# Altium schematic sheet PSU.SchDoc
size A4
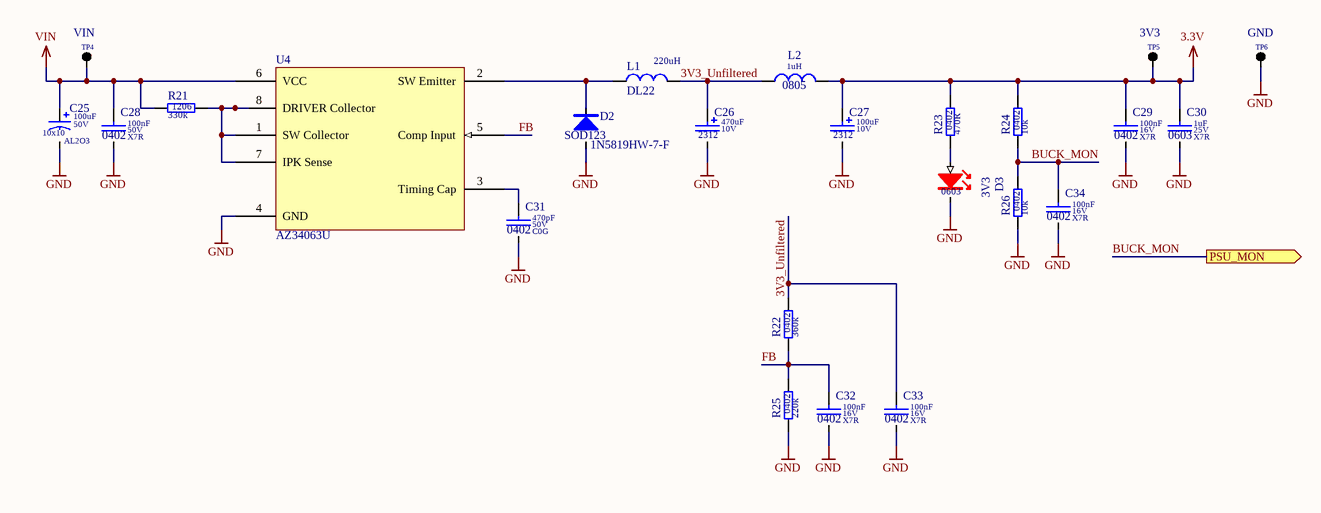
[diagram p0: PSU.SchDoc]

## Parts
C25  value 100uF  Dielectric: AL2O3  SCH_Footprint: 10x10  Voltage: 50V  [CE_D_10x10MM]  (hidden comment: Electrolytic Capacitor)
C26  value 470uF  SCH_Footprint: 2312  Voltage: 10V  [CT_2312_6032]  (hidden comment: Tantalum Capacitor)
C27  value 100uF  SCH_Footprint: 2312  Voltage: 10V  [CT_2312_6032]  (hidden comment: Tantalum Capacitor)
C28  value 100nF  Dielectric: X7R  Voltage: 50V  SCH_Footprint: 0402  [C_0402_1005]  (hidden comment: Ceramic X7R)
C29  value 100nF  Dielectric: X7R  Voltage: 16V  SCH_Footprint: 0402  [C_0402_1005]  (hidden comment: Ceramic X7R)
C30  value 1uF  Dielectric: X7R  Voltage: 25V  SCH_Footprint: 0603  [C_0603_1608]  (hidden comment: Ceramic X7R)
C31  value 470pF  Dielectric: C0G  Voltage: 50V  SCH_Footprint: 0402  [C_0402_1005]  (hidden comment: Ceramic C0G)
C32  value 100nF  Dielectric: X7R  Voltage: 16V  SCH_Footprint: 0402  [C_0402_1005]  (hidden comment: Ceramic X7R)
C33  value 100nF  Dielectric: X7R  Voltage: 16V  SCH_Footprint: 0402  [C_0402_1005]  (hidden comment: Ceramic X7R)
C34  value 100nF  Dielectric: X7R  Voltage: 16V  SCH_Footprint: 0402  [C_0402_1005]  (hidden comment: Ceramic X7R)
D2  value 1N5819HW-7-F  [SOD123]  (hidden comment: 1N5819HW)
D3  3V3  SCH_Footprint: 0603  [OL_0603_1608]
L1  DL22  value 220uH  [DL22]
L2  value 1uH  SCH_Footprint: 0805  [L_0805_2012]  (hidden comment: Inductor)
R21  value 330k  SCH_Footprint: 1206  [R_1206_3216]  (hidden comment: Resistor)
R22  value 360k  SCH_Footprint: 0402  [R_0402_1005]  (hidden comment: Resistor)
R23  value 470R  SCH_Footprint: 0402  [R_0402_1005]  (hidden comment: Resistor)
R24  value 10k  SCH_Footprint: 0402  [R_0402_1005]  (hidden comment: Resistor)
R25  value 220k  SCH_Footprint: 0402  [R_0402_1005]  (hidden comment: Resistor)
R26  value 10k  SCH_Footprint: 0402  [R_0402_1005]  (hidden comment: Resistor)
TP4  VIN  [TP_PAD]
TP5  3V3  [TP_PAD]
TP6  GND  [TP_PAD]
U4  AZ34063U  [AZ34063UMTR-G1]

## Ports
PSU_MON (out)

## Nets
3.3V: C27.1 C29.1 C30.1 L2.2 R23.2 R24.2 TP5.1(TP)
GND: C25.2 C26.2 C27.2 C28.2 C29.2 C30.2 C31.2 C32.2 C33.2 C34.2 D2.2 D3.1(K) R25.1 R26.1 TP6.1(TP) U4.4(GND)
VIN: C25.1 C28.1 R21.1 TP4.1(TP) U4.6(VCC)
3V3_Unfiltered: C26.1 C33.1 L1.1 L2.1 R22.2
BUCK_MON: C34.1 R24.1 R26.2 ; port PSU_MON
FB: C32.1 R22.1 R25.2 U4.5(Comp_Input)
NetC31_1: C31.1 U4.3(Timing_Cap)
NetD2_1: D2.1 L1.2 U4.2(SW_Emitter)
NetD3_2: D3.2(A) R23.1
NetR21_2: R21.2 U4.1(SW_Collector) U4.7(IPK_Sense) U4.8(DRIVER_Collector)

## Library data of the parts
C25 = CE_100uF_50V_AL2O3_10x10_20: Polarized Capacitor; Manufacturer: Nichicon; Manufacturer Part Number: UUX1H101MNL1GS; Tolerance (%): 20; Part Number: CE_100uF_50V_AL2O3_10x10_20; HelpURL: https://datasheet.octopart.com/UUX1H101MNL1GS-Nichicon-datasheet-62047998.pdf; Supplier 1: TME; Supplier Part Number 1: UUX1H101MNL1GS; Supplier 2: RS Components; Supplier Part Number 2: 739-3107; Supplier 3: Farnell; Supplier Part Number 3: 2841943; Supplier 4: Mouser; Supplier Part Number 4: 647-UUX1H101MNL1GS; Supplier 5: Digi-Key; Supplier Part Number 5: 493-6269-1-ND; Supplier 6: LCSC
C26 C27 = CT_22uF_16V_TA2O5_2312_10: Capacitor; Manufacturer: Kemet; Manufacturer Part Number: T494C226K016AT; Dielectric: TA2O5; Tolerance (%): 10; Part Number: CT_22uF_16V_TA2O5_2312_10; HelpURL: https://content.kemet.com/datasheets/KEM_T2008_T494.pdf; Supplier 1: TME; Supplier Part Number 1: T494C226K016AT; Supplier 2: RS Components; Supplier Part Number 2: 1726639; Supplier 3: Farnell; Supplier Part Number 3: 2762195; Supplier 4: Mouser; Supplier Part Number 4: 80-T494C226K016; Supplier 5: Digi-Key; Supplier Part Number 5: 399-3845-1-ND; Supplier 6: LCSC
C28 = C_100nF_50V_X7R_0402_10: Capacitor; Manufacturer: Murata; Manufacturer Part Number: GRM155R71H104KE14D; Tolerance (%): 10; Part Number: C_100nF_50V_X7R_0402_10; HelpURL: http://docs-europe.electrocomponents.com/webdocs/145f/0900766b8145f9d2.pdf; Supplier 1: TME; Supplier Part Number 1: GRM155R71H104KE14D; Supplier 2: RS Components; Supplier Part Number 2: 8847087; Supplier 3: Farnell; Supplier Part Number 3: 2611912; Supplier 4: Mouser; Supplier Part Number 4: 81-GRM155R71H104KE4D; Supplier 5: Digi-Key; Supplier Part Number 5: 490-10700-1-ND; Supplier 6: LCSC
C29 C32-C34 = C_100nF_16V_X7R_0402_10: Capacitor; Manufacturer: Murata; Manufacturer Part Number: GRM155R71C104KA88D; Tolerance (%): 10; Part Number: C_100nF_16V_X7R_0402_10; HelpURL: https://www.mouser.com/ds/2/281/c02e-2905.pdf; Supplier 1: TME; Supplier 2: RS Components; Supplier 3: Farnell; Supplier 4: Mouser; Supplier Part Number 4: 81-GRM155R71C104KA88; Supplier 5: Digi-Key
  C32-C34: Supplier 6: LCSC
C30 = C_1uF_25V_X7R_0603_10: Capacitor; Manufacturer: Samsung; Manufacturer Part Number: CL10B105KA8NNNC; Tolerance (%): 10; Part Number: C_1uF_25V_X7R_0603_10; HelpURL: http://www.tme.eu/pl/Document/4a42202b32dab16128fe107dd69598cc/samsung-chip-cap.pdf; Supplier 1: TME; Supplier Part Number 1: CL10B105KA8NNNC; Supplier 2: RS Components; Supplier 3: Farnell; Supplier 4: Mouser; Supplier 5: Digi-Key
C31 = C_470pF_50V_C0G_0402_5: Capacitor; Manufacturer: AVX; Manufacturer Part Number: 04025A471JAT2A; Tolerance (%): 5; Part Number: C_470pF_50V_C0G_0402_5; HelpURL: http://datasheet.octopart.com/04025A471JAT2A-AVX-datasheet-9883399.pdf; Supplier 1: TME; Supplier 2: RS Components; Supplier Part Number 2: 6983119P; Supplier 3: Farnell; Supplier Part Number 3: 2280781; Supplier 4: Mouser; Supplier Part Number 4: 581-04025A471JAT2A; Supplier 5: Digi-Key; Supplier Part Number 5: 478-7880-1-ND; Supplier 6: LCSC
D2 = D_1N5819HW_1A_40V_SOD123: Manufacturer: Diodes Inc; Voltage: 40V; Current: 1A; SCH_Footprint: SOD123; Part Number: D_1N5819HW_1A_40V_SOD123; HelpURL: https://datasheet.octopart.com/1N5819HW-7-F-Diodes-Inc.-datasheet-8332965.pdf; Manufacturer Part Number: 1N5819HW-7-F; Supplier 1: TME; Supplier Part Number 1: 1N5819HW-7-F; Supplier 2: RS Components; Supplier Part Number 2: 7082197; Supplier 3: Farnell; Supplier Part Number 3: 1773475; Supplier 4: Mouser; Supplier Part Number 4: 621-1N5819HW-F; Supplier 5: Digi-Key; Supplier Part Number 5: 1N5819HW-FDICT-ND; Supplier 6: LCSC
D3 = OL_R_0603: LED_RED; Manufacturer: Lite-On; Value: LTST-C190KRKT; Part Number: OL_R_0603; HelpURL: https://datasheet.octopart.com/LTST-C190KRKT-Lite-On-datasheet-158191.pdf; Manufacturer Part Number: LTST-C190KRKT; Supplier 1: TME; Supplier Part Number 1: LTST-C190KRKT; Supplier 2: RS Components; Supplier Part Number 2: 1769795; Supplier 3: Farnell; Supplier 4: Mouser; Supplier Part Number 4: 859-LTST-C190KRKT; Supplier 5: Digi-Key; Supplier Part Number 5: 160-1436-1-ND
L1 = DL22: Dławik: drutowy; SMD; 1uH; Ipracy: 7,1A; 8mΩ; Isat: 7,6A; B: 9,4mm
L2 = L_15uH_250mA_0805: Induction; Part Number: NL05KTC1R0; Manufacturer: VIKING; Current: 1100mA; Resistance: 169mR; HelpURL: https://www.tme.eu/pl/details/nl05ktc1r0/dlawiki-smd-0805/viking/; Manufacturer Part Number: NL05KTC1R0; Supplier 1: TME; Supplier 2: RS Components; Supplier 3: Farnell; Supplier Part Number 3: 2215651; Supplier 4: Mouser; Supplier Part Number 4: 810-MLZ2012M150WT000; Supplier 5: Digi-Key; Supplier Part Number 5: 445-6397-1-ND; Supplier 6: LCSC; Supplier Part Number 6: C383402
R21 = R_330k_1206_1: Manufacturer: Yageo; Manufacturer Part Number: RC1206FR-07330KL; Voltage: 200V; Power: 250mW; Tolerance: 1%; Part Number: R_330k_1206_1; HelpURL: https://datasheet.octopart.com/RC1206FR-07330KL-Yageo-datasheet-8359522.pdf; Supplier 1: TME; Supplier Part Number 1: RC1206FR-07330KL; Supplier 2: RS Components; Supplier Part Number 2: 1995833; Supplier 3: Farnell; Supplier Part Number 3: 9241094; Supplier 4: Mouser; Supplier Part Number 4: 603-RC1206FR-07330KL; Supplier 5: Digi-Key; Supplier Part Number 5: 311-330KFRCT-ND; Supplier 6: LCSC
R22 = R_360R_0402_1: Manufacturer: Yageo; Manufacturer Part Number: RC0402FR-07360RL; Voltage: 50V; Power: 63mW; Tolerance: 1%; Part Number: R_360R_0402_1; HelpURL: https://datasheet.octopart.com/RC0402FR-07360RL-Yageo-datasheet-62067350.pdf; Supplier 1: TME; Supplier 2: RS Components; Supplier 3: Farnell; Supplier Part Number 3: 2693605; Supplier 4: Mouser; Supplier Part Number 4: 603-RC0402FR-07360RL; Supplier 5: Digi-Key; Supplier Part Number 5: YAG3132CT-ND; Supplier 6: LCSC
R23 = R_470R_0402_1: Manufacturer: Yageo; Manufacturer Part Number: RC0402FR-07470RL; Voltage: 50V; Power: 63mW; Tolerance: 1%; Part Number: R_470R_0402_1; HelpURL: http://datasheet.octopart.com/RC0402FR-07470RL-Yageo-datasheet-10408619.pdf; Supplier 1: TME; Supplier Part Number 1: RC0402FR-07470R; Supplier 2: RS Components; Supplier 3: Farnell; Supplier Part Number 3: 9239197; Supplier 4: Mouser; Supplier Part Number 4: 603-RC0402FR-07470RL; Supplier 5: Digi-Key; Supplier Part Number 5: 311-470LRCT-ND
R24 R26 = R_10k_0402_1: Manufacturer: Yageo; Manufacturer Part Number: RC0402FR-0710KL; Voltage: 50V; Power: 63mW; Tolerance: 1%; Part Number: R_10k_0402_1; HelpURL: http://www.tme.eu/pl/Document/1a2bc76e2be68b3b1670068306778ce6/rc0402yageo.pdf; Supplier 1: TME; Supplier Part Number 1: RC0402FR-0710K; Supplier 2: RS Components; Supplier 3: Farnell; Supplier 4: Mouser; Supplier 5: Digi-Key; Supplier 6: LCSC
R25 = R_220k_0402_1: Manufacturer: Vishay; Manufacturer Part Number: CRCW0402220KFKED; Voltage: 50V; Power: 63mW; Tolerance: 1%; Part Number: R_220k_0402_1; HelpURL: https://www.farnell.com/datasheets/2310790.pdf; Supplier 1: TME; Supplier 2: RS Components; Supplier Part Number 2: 678-8967; Supplier 3: Farnell; Supplier Part Number 3: 2140958; Supplier 4: Mouser; Supplier Part Number 4: 71-CRCW0402-220K-E3; Supplier 5: Digi-Key; Supplier Part Number 5: 541-220KLCT-ND; Supplier 6: LCSC
TP4-TP6 = TP_PAD: Testpoint; SCH_Footprint: SMD; Part Number: TP_PAD; Supplier 1: TME; Supplier 2: RS Components; Supplier 3: Farnell; Supplier 4: Mouser; Supplier 5: Digi-Key
  TP4 TP5: Component Type: Standard (No BOM)
  TP6: Supplier 6: LCSC
U4 = AZ34063UMTR-G1: IC: PMIC; przetwornica DC/DC; Uwej: 3÷36VDC; Uwyj: 1,25÷36VDC; 1,5A